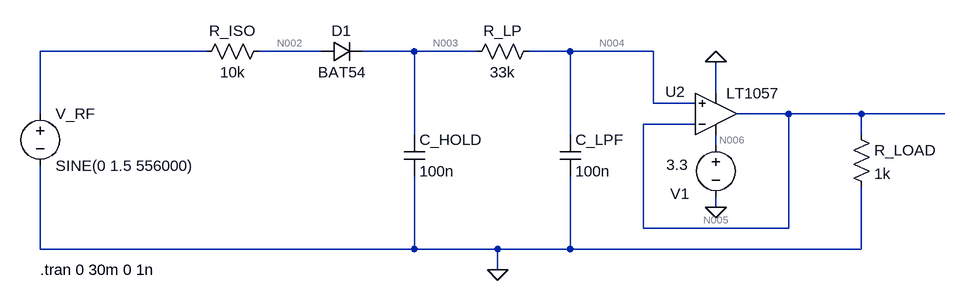
[diagram p0: schematic Envelope Detector.asc]
Envelope Detector.asc, the LTspice schematic file:
Version 4.1
SHEET 1 1684 680
WIRE 320 0 64 0
WIRE 496 0 400 0
WIRE 640 0 560 0
WIRE 736 0 640 0
WIRE 880 0 816 0
WIRE 1008 0 880 0
WIRE 1104 64 1104 16
WIRE 1008 80 1008 0
WIRE 1072 80 1008 80
WIRE 64 96 64 0
WIRE 1216 96 1136 96
WIRE 1328 96 1216 96
WIRE 1456 96 1328 96
WIRE 1072 112 992 112
WIRE 640 128 640 0
WIRE 880 128 880 0
WIRE 1328 128 1328 96
WIRE 1104 144 1104 128
WIRE 1104 240 1104 224
WIRE 992 272 992 112
WIRE 1216 272 1216 96
WIRE 1216 272 992 272
WIRE 64 304 64 176
WIRE 640 304 640 192
WIRE 640 304 64 304
WIRE 768 304 640 304
WIRE 880 304 880 192
WIRE 880 304 768 304
WIRE 1328 304 1328 208
WIRE 1328 304 880 304
WIRE 768 336 768 304
FLAG 768 336 0
FLAG 1104 16 0
FLAG 1104 240 0
SYMBOL voltage 64 80 R0
WINDOW 123 0 0 Left 0
WINDOW 39 0 0 Left 0
SYMATTR InstName V_RF
SYMATTR Value SINE(0 1.5 556000)
SYMBOL res 416 -16 R90
WINDOW 0 0 56 VBottom 2
WINDOW 3 32 56 VTop 2
SYMATTR InstName R_ISO
SYMATTR Value 10k
SYMBOL cap 624 128 R0
SYMATTR InstName C_HOLD
SYMATTR Value 100n
SYMBOL res 832 -16 R90
WINDOW 0 0 56 VBottom 2
WINDOW 3 32 56 VTop 2
SYMATTR InstName R_LP
SYMATTR Value 33k
SYMBOL cap 864 128 R0
SYMATTR InstName C_LPF
SYMATTR Value 100n
SYMBOL OpAmps\\LT1057 1104 160 M180
WINDOW 0 -78 98 Left 2
SYMATTR InstName U2
SYMBOL res 1312 112 R0
SYMATTR InstName R_LOAD
SYMATTR Value 1k
SYMBOL voltage 1104 128 R0
WINDOW 0 -70 91 Left 2
WINDOW 3 -76 46 Left 2
WINDOW 123 37 1 Left 2
WINDOW 39 0 0 Left 0
SYMATTR InstName V1
SYMATTR Value 3.3
SYMBOL diode 496 16 R270
WINDOW 0 32 32 VTop 2
WINDOW 3 0 32 VBottom 2
SYMATTR InstName D1
SYMATTR Value BAT54
TEXT 64 336 Left 2 !.tran 0 30m 0 1n

The netlist it stands for:
* Envelope Detector.asc
V_RF N001 0 SINE(0 1.5 556000)
R_ISO N002 N001 10k
C_HOLD N003 0 100n
R_LP N004 N003 33k
C_LPF N004 0 100n
X§U2 N004 N005 N006 0 N005 LT1057  ; pins In+ In- V+ V- OUT
R_LOAD N005 0 1k
V1 N006 0 3.3
D1 N002 N003 BAT54
.model D D
.lib standard.dio
.tran 0 30m 0 1n
.lib LTC.lib
.backanno
.end

* Results of the author's LTspice run, read from the files saved beside the schematic
* Operating Point, zero values left out:
*   V(n002) = 16.5 nV
*   V(n003) = 443.3 nV
*   V(n004) = 497.7 nV
*   V(n005) = 1.553 V
*   V(n006) = 3.3 V
*   I(D1) = -1.65 pA
*   I(R_ISO) = 1.65 pA
*   I(R_LOAD) = 1.553 mA
*   I(R_LP) = 1.65 pA
*   I(V1) = -2.46 mA
*   I(V_RF) = 1.65 pA
*   Ix(u2:1) = -1.65 pA
*   Ix(u2:3) = 2.46 mA
*   Ix(u2:4) = -906.4 µA
*   Ix(u2:5) = -1.553 mA